# Altium project Timer_Clock_BOT.PrjPcb
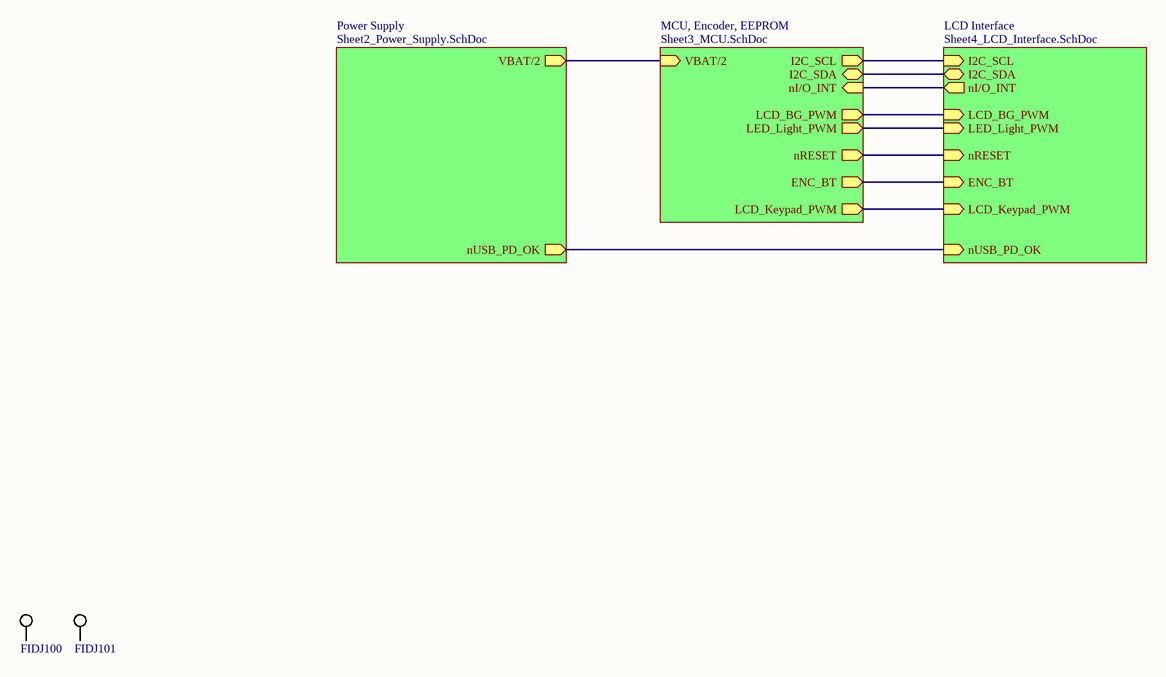
[diagram p0: Sheet1_Overview.SchDoc]
ProjectName: Alarm Clock - PCB BOT; Revision: V2.0; Signature1: Marius Tetard; Signature2: 2022-06 / Freiburg
4 sheets, 131 parts. Net scope: hierarchical (ports join the sheet entries above them; power ports are global).
Sheets:
  Sheet1_Overview.SchDoc
    Power Supply = Sheet2_Power_Supply.SchDoc
    MCU, Encoder, EEPROM = Sheet3_MCU.SchDoc
    LCD Interface = Sheet4_LCD_Interface.SchDoc

## Sheet Sheet1_Overview.SchDoc: =ProjectName
size A4; Organization: Marius Tetard; Address1: 2022-06 / Freiburg; DocumentNumber: 1; Revision: V2.0; SheetNumber: 1; SheetTotal: 4

### Parts
FIDJ100  Fiducial  [FIDJ_1mm]  (value not drawn)  (net tie, no BOM)
FIDJ101  Fiducial  [FIDJ_1mm]  (value not drawn)  (net tie, no BOM)

### Sub-sheets
LCD Interface = Sheet4_LCD_Interface.SchDoc: nI/O_INT (out), I2C_SCL (in), LCD_BG_PWM (in), nRESET (in), LED_Light_PWM (in), I2C_SDA (bidir), ENC_BT (in), LCD_Keypad_PWM (in), nUSB_PD_OK (in)
MCU, Encoder, EEPROM = Sheet3_MCU.SchDoc: nI/O_INT (in), I2C_SCL (out), LCD_BG_PWM (out), LED_Light_PWM (out), I2C_SDA (bidir), VBAT/2 (in), LCD_Keypad_PWM (out), nRESET (out), ENC_BT (out)
Power Supply = Sheet2_Power_Supply.SchDoc: nUSB_PD_OK (out), VBAT/2 (out)

### Nets
ENC_BT: sheet MCU, Encoder, EEPROM/ENC_BT, sheet LCD Interface/ENC_BT
I2C_SCL: sheet MCU, Encoder, EEPROM/I2C_SCL, sheet LCD Interface/I2C_SCL
I2C_SDA: sheet MCU, Encoder, EEPROM/I2C_SDA, sheet LCD Interface/I2C_SDA
LCD_BG_PWM: sheet MCU, Encoder, EEPROM/LCD_BG_PWM, sheet LCD Interface/LCD_BG_PWM
LCD_Keypad_PWM: sheet MCU, Encoder, EEPROM/LCD_Keypad_PWM, sheet LCD Interface/LCD_Keypad_PWM
LED_Light_PWM: sheet MCU, Encoder, EEPROM/LED_Light_PWM, sheet LCD Interface/LED_Light_PWM
nI/O_INT: sheet MCU, Encoder, EEPROM/nI/O_INT, sheet LCD Interface/nI/O_INT
nRESET: sheet MCU, Encoder, EEPROM/nRESET, sheet LCD Interface/nRESET
nUSB_PD_OK: sheet Power Supply/nUSB_PD_OK, sheet LCD Interface/nUSB_PD_OK
VBAT/2: sheet Power Supply/VBAT/2, sheet MCU, Encoder, EEPROM/VBAT/2

Not connected (* = marked no-connect by the designer): FIDJ100 1; FIDJ101 1

### Notes on the sheet
- Title
- Size:
- Date:
- A4
- Number:
- Time:
- Revision:
- Sheet
- of
- File:

### Library data of the parts
FIDJ100 FIDJ101 = FIDJ_1mm: Fiducal 1mm

## Sheet Sheet2_Power_Supply.SchDoc: =ProjectName
size A4; Organization: Marius Tetard; Address1: 2022-06 / Freiburg; DocumentNumber: 2; Revision: V2.0; SheetNumber: 2; SheetTotal: 4
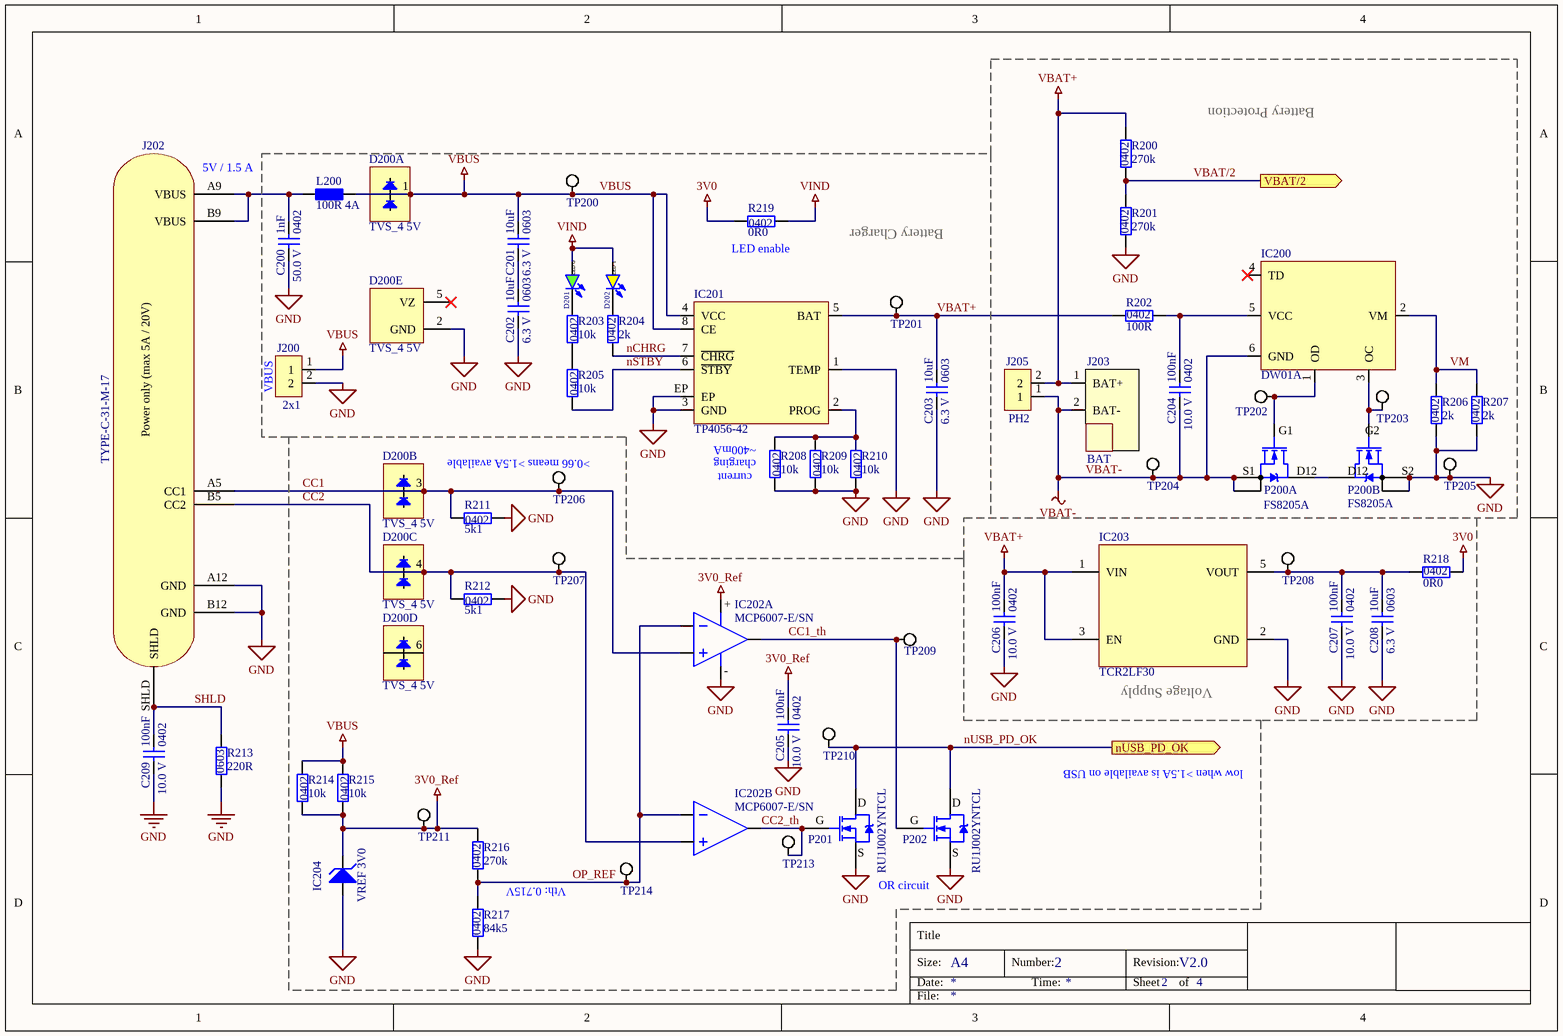
[diagram p1: Sheet2_Power_Supply.SchDoc]

### Parts
C200  Capacitance: 1nF  Footprint: 0402  Voltage: 50.0 V  [C_0402]  (hidden comment: C 1nF 0402 50V)
C201  Capacitance: 10uF  Footprint: 0603  Voltage: 6.3 V  [C_0603]  (hidden comment: C 10uF 0603 6.3V)
C202  Capacitance: 10uF  Footprint: 0603  Voltage: 6.3 V  [C_0603]  (hidden comment: C 10uF 0603 6.3V)
C203  Capacitance: 10uF  Footprint: 0603  Voltage: 6.3 V  [C_0603]  (hidden comment: C 10uF 0603 6.3V)
C204  Capacitance: 100nF  Footprint: 0402  Voltage: 10.0 V  [C_0402]  (hidden comment: C 100nF 0402 10V)
C205  Capacitance: 100nF  Footprint: 0402  Voltage: 10.0 V  [C_0402]  (hidden comment: C 100nF 0402 10V)
C206  Capacitance: 100nF  Footprint: 0402  Voltage: 10.0 V  [C_0402]  (hidden comment: C 100nF 0402 10V)
C207  Capacitance: 100nF  Footprint: 0402  Voltage: 10.0 V  [C_0402]  (hidden comment: C 100nF 0402 10V)
C208  Capacitance: 10uF  Footprint: 0603  Voltage: 6.3 V  [C_0603]  (hidden comment: C 10uF 0603 6.3V)
C209  Capacitance: 100nF  Footprint: 0402  Voltage: 10.0 V  [C_0402]  (hidden comment: C 100nF 0402 10V)
D200  TVS_4 5V  [SOT-23-6]  (parts A,B,C,D,E of 5)
D201  LED G  [LED_0603]
D202  LED Y  [LED_0603]
IC200  DW01A  [SOT-23-6]
IC201  TP4056-42  [SOIC-8-EP]
IC202  MCP6007-E/SN  [SOIC-8]  (parts A,B of 2)
IC203  TCR2LF30  [SOT-23-5]
IC204  VREF 3V0  [SOT-23-3]
J200  2x1  [PH_1x2]
J202  TYPE-C-31-M-17  [Con_TYPE-C-31-M-17]
J203  BAT  [J_BAT_CLIP_18650]
J204  BAT  (value not drawn)  (mechanical)
J205  PH2  [J_S2B-PH-K-S]
L200  Inductance: 100R 4A  [L_1206]  (hidden comment: L Ferrite 100R 4A)
P200  Manufacturer Part Number: FS8205A  [TSSOP-8_4.4mm]  (hidden comment: P2 NMOS 20V 6A)  (parts A,B of 2)
P201  Manufacturer Part Number: RU1J002YNTCL  [UMT3F]  (hidden comment: P_NCH_50V_150mW)
P202  Manufacturer Part Number: RU1J002YNTCL  [UMT3F]  (hidden comment: P_NCH_50V_150mW)
R200  Resistance: 270k  Footprint: 0402  [R_0402]  (hidden comment: R 270k 0402)
R201  Resistance: 270k  Footprint: 0402  [R_0402]  (hidden comment: R 270k 0402)
R202  Resistance: 100R  Footprint: 0402  [R_0402]  (hidden comment: R 100R 0402)
R203  Resistance: 10k  Footprint: 0402  [R_0402]  (hidden comment: R 10k 0402)
R204  Resistance: 2k  Footprint: 0402  [R_0402]  (hidden comment: R 2k 0402)
R205  Resistance: 10k  Footprint: 0402  [R_0402]  (hidden comment: R 10k 0402)
R206  Resistance: 2k  Footprint: 0402  [R_0402]  (hidden comment: R 2k 0402)
R207  Resistance: 2k  Footprint: 0402  [R_0402]  (hidden comment: R 2k 0402)
R208  Resistance: 10k  Footprint: 0402  [R_0402]  (hidden comment: R 10k 0402)
R209  Resistance: 10k  Footprint: 0402  [R_0402]  (hidden comment: R 10k 0402)
R210  Resistance: 10k  Footprint: 0402  [R_0402]  (hidden comment: R 10k 0402)
R211  Resistance: 5k1  Footprint: 0402  [R_0402]  (hidden comment: R 5k1 0402)
R212  Resistance: 5k1  Footprint: 0402  [R_0402]  (hidden comment: R 5k1 0402)
R213  Resistance: 220R  Footprint: 0603  [R_0603]  (hidden comment: R 220R 0603)
R214  Resistance: 10k  Footprint: 0402  [R_0402]  (hidden comment: R 10k 0402)
R215  Resistance: 10k  Footprint: 0402  [R_0402]  (hidden comment: R 10k 0402)
R216  Resistance: 270k  Footprint: 0402  [R_0402]  (hidden comment: R 270k 0402)
R217  Resistance: 84k5  Footprint: 0402  [R_0402]  (hidden comment: R 84k5 0402)
R218  Resistance: 0R0  Footprint: 0402  [R_0402]  (hidden comment: R 0R0 0402)
R219  Resistance: 0R0  Footprint: 0402  [R_0402]  (hidden comment: R 0R0 0402)
TP200  TP  [TP_1mm]  (value not drawn)  (net tie, no BOM)
TP201  TP  [TP_1mm]  (value not drawn)  (net tie, no BOM)
TP202  TP  [TP_1mm]  (value not drawn)  (net tie, no BOM)
TP203  TP  [TP_1mm]  (value not drawn)  (net tie, no BOM)
TP204  TP  [TP_1mm]  (value not drawn)  (net tie, no BOM)
TP205  TP  [TP_1mm]  (value not drawn)  (net tie, no BOM)
TP206  TP  [TP_1mm]  (value not drawn)  (net tie, no BOM)
TP207  TP  [TP_1mm]  (value not drawn)  (net tie, no BOM)
TP208  TP  [TP_1mm]  (value not drawn)  (net tie, no BOM)
TP209  TP  [TP_1mm]  (value not drawn)  (net tie, no BOM)
TP210  TP  [TP_1mm]  (value not drawn)  (net tie, no BOM)
TP211  TP  [TP_1mm]  (value not drawn)  (net tie, no BOM)
TP213  TP  [TP_1mm]  (value not drawn)  (net tie, no BOM)
TP214  TP  [TP_1mm]  (value not drawn)  (net tie, no BOM)

### Ports
nUSB_PD_OK (out), VBAT/2 (out)

### Nets
3V0: R218.2 R219.2
3V0_Ref: C205.2 IC202.8(VDD) IC204.1(K) R214.1 R215.1 R216.2 TP211.1(TP)
GND: C200.1 C202.1 C203.1 C205.1 C206.1 C207.1 C208.1 C209.1 D200.2(GND) IC201.1(TEMP) IC201.3(GND) IC201.EP IC202.4(VSS) IC203.2(GND) IC204.2(A) J200.2 J202.A12(GND) J202.B12(GND) P200.6(S2) P200.7(S2) P201.2(S) P202.2(S) R201.1 R206.1 R207.1 R208.1 R209.1 R210.1 R211.1 R212.1 R213.1 R217.1 TP205.1(TP)
VBAT+: C203.2 C206.2 IC201.5(BAT) IC203.1(VIN) IC203.3(EN) J203.1(BAT+) J205.2 R200.2 R202.1 TP201.1(TP)
VBAT-: C204.1 IC200.6(GND) J203.2(BAT-) J205.1 P200.2(S1) P200.3(S1) TP204.1(TP)
VBUS: C201.2 D200.1 IC201.4(VCC) IC201.8(CE) J200.1 L200.2 R214.2 R215.2 TP200.1(TP)
VIND: D201.A D202.A R219.1
CC1: D200.3 IC202.3(INA+) J202.A5(CC1) R211.2 TP206.1(TP)
CC1_th: IC202.1(OUTA) P202.1(G) TP209.1(TP)
CC2: D200.4 IC202.5(INB+) J202.B5(CC2) R212.2 TP207.1(TP)
CC2_th: IC202.7(OUTB) P201.1(G) TP213.1(TP)
nCHRG: IC201.7(~{CHRG}) R204.1
nSTBY: IC201.6(~{STBY}) R205.1
nUSB_PD_OK: P201.3(D) P202.3(D) TP210.1(TP) ; port nUSB_PD_OK
OP_REF: IC202.2(INA-) IC202.6(INB-) R216.1 R217.2 TP214.1(TP)
SHLD: C209.2 J202.SHLD R213.2
VBAT/2: R200.1 R201.2 ; port VBAT/2
VM: IC200.2(VM) R206.2 R207.2
NetC200_2: C200.2 J202.A9(VBUS) J202.B9(VBUS) L200.1
NetC201_1: C201.1 C202.2
NetC204_2: C204.2 IC200.5(VCC) R202.2
NetC207_2: C207.2 C208.2 IC203.5(VOUT) R218.1 TP208.1(TP)
NetD201_K: D201.K R203.2
NetD202_K: D202.K R204.2
NetIC200_1: IC200.1(OD) P200.4(G1) TP202.1(TP)
NetIC200_3: IC200.3(OC) P200.5(G1) TP203.1(TP)
NetIC201_2: IC201.2(PROG) R208.2 R209.2 R210.2
NetP200_1: P200.1(D12) P200.8(D12)
NetR203_1: R203.1 R205.2

Not connected (* = marked no-connect by the designer): D200 5(VZ)* 6; IC200 4(TD)*

### Notes on the sheet
- Battery Protection
- (near J202) 5V / 1.5 A
- (near R219) LED enable
- Battery Charger
- (near J200) VBUS
- ~400mA
- (near TP206) >0.66 means >1.5A available
- (near R208) charging
- (near R208) current
- (near IC203) Voltage Supply
- low when >1.5A is available on USB
- Vth: 0.715V
- OR circuit
- Title
- Size:
- Date:
- A4
- Number:
- Time:
- Revision:
- Sheet
- of
- File:
- (in symbol IC_OpAmp_MCP6007-E/SN, part A) +; -
- (in symbol J_USB-C_2) Power only (max 5A / 20V)
- (in symbol P_2NCH_20V_1W, part B) G2

### Library data of the parts
C200 = CAP_1nF_50V_0402: CAP CER 1000PF 50V C0G/NP0 0402; Manufacturer: Murata Electronics; Manufacturer Part Number: GRM1555C1H102JA01J; Type: Capacitor; Supplier 1: Digi-Key; Supplier Part Number 1: 490-6190-1-ND
C201-C203 C208 = CAP_10uF_6V3_0603: CAP CER 10UF 6.3V X5R 0603; Manufacturer: Taiyo Yuden; Manufacturer Part Number: JMK107ABJ106MA-T; Type: Capacitor; Supplier 1: Digi-Key; Supplier Part Number 1: 587-5869-1-ND
C204-C207 C209 = CAP_100nF_10V_0402: CAP CER 0.1UF 10V X5R 0402; Manufacturer: Samsung Electro-Mechanics; Manufacturer Part Number: CL05A104MP5NNNC; Type: Capacitor; Supplier 1: Digi-Key; Supplier Part Number 1: 1276-1443-1-ND
D200 = D_TVS_U4_12V5: TVS DIODE 5VWM 12.5VC SOT23-6; Manufacturer: Comchip Technology; Manufacturer Part Number: CPDT6-5V0UPC-HF; Type: Diode, TVS; Supplier 1: Digi-Key; Supplier Part Number 1: 641-1829-1-ND
D201 = D_LED_Green_0603: LED GREEN DIFFUSED 0603 SMD; Manufacturer: OSRAM Opto Semiconductors Inc.; Manufacturer Part Number: LT Q39G-Q1OO-25-1; Type: Diode, LED; Supplier 1: Digi-Key; Supplier Part Number 1: 475-3442-1-ND
D202 = D_LED_Yellow_0603: LED YELLOW DIFFUSED; Manufacturer: Stanley Electric Co; Manufacturer Part Number: FKY1111C-TR; Type: Diode, LED; Supplier 1: Digi-Key; Supplier Part Number 1: 404-1273-1-ND
IC200 = IC_BAT_PROT_DW01A: IC BATT MANAGEMENT SOT-23-6; Manufacturer: PUOLOP; Manufacturer Part Number: DW01A; Type: IC; Supplier 1: LCSC; Supplier Part Number 1: C351410
IC201 = IC_BAT_CHGR_TP4056: IC BATT CHG LI-ION 1CELL ESOP-8-EP; Manufacturer: TOPPOWER(Nanjing Extension Microelectronics); Manufacturer Part Number: TP4056-42-ESOP8; Type: IC; Supplier 1: LCSC; Supplier Part Number 1: C16581
IC202 = IC_OpAmp_MCP6007-E/SN: DUAL, 1MHZ OP AMP, E TEMP; Manufacturer: Microchip Technology; Type: IC, OpAmp; Supplier 1: Digi-Key; Supplier Part Number 1: 150-MCP6007-E/SN-ND; Manufacturer Part Number: MCP6007-E/SN
IC203 = IC_Reg_TCR2LF30: IC REG LINEAR 3V 200MA SMV; Manufacturer: Toshiba Semiconductor and Storage; Manufacturer Part Number: TCR2LF30,LM(CT; Type: IC, Regulator; Supplier 1: Digi-Key; Supplier Part Number 1: TCR2LF30LM(CTCT-ND
IC204 = IC_Ref_LM4040DIM3X-3.0: IC VREF SHUNT 1% SOT23-3; Manufacturer: Texas Instruments; Manufacturer Part Number: LM4040DIM3X-3.0/NOPB; Type: IC, Reference; Supplier 1: Digi-Key; Supplier Part Number 1: 296-41429-1-ND
J200 = J_MH2x1_2.54: CONN HEADER VERT 2POS 2.54MM; Manufacturer: Sullins Connector Solutions; Manufacturer Part Number: PRPC002SAAN-RC; Pitch: 2.54; Type: Connector; Supplier 1: Digi-Key; Supplier Part Number 1: S1011EC-02-ND; Pins: 2
J202 = J_USB-C_2: USB4 GEN3, TYPE C, TOP MOUNT; Manufacturer: Korean Hroparts Elec; Manufacturer Part Number: TYPE-C-31-M-17; Type: Connector; Supplier 1: LCSC; Supplier Part Number 1: C283540; Pins: 6; Pitch: *
J203 = J_BAT_CLIP_18650_A: SMT Battery Connectors 18650; Manufacturer: MYOUNG; Manufacturer Part Number: MY-18650-02; Type: other; Supplier 1: LCSC; Supplier Part Number 1: C2979182; Pins: 2
J204 = J_BAT_CLIP_18650_B: SMT Battery Connectors 18650; Manufacturer: MYOUNG; Manufacturer Part Number: MY-18650-02; Type: other; Supplier 1: LCSC; Supplier Part Number 1: C2979182; Pins: 2
J205 = J_S2B-PH-KL: CONN HEADER R/A 2POS 2MM; Manufacturer: JST Sales America Inc.; Manufacturer Part Number: S2B-PH-KL(LF)(SN); Pitch: 2; Type: Connector; Supplier 1: LCSC; Supplier Part Number 1: C160237; Pins: 2
L200 = L_100R_4A: FIXED IND 100 4000MA 1206; Manufacturer: Eaton - Electronics Division; Manufacturer Part Number: MFBM1V3216-101-R; Type: Inductor, Ferrite; Supplier 1: Digi-Key; Supplier Part Number 1: 283-MFBM1V3216-101-RCT-ND
P200 = P_2NCH_20V_1W: MOSFET 2N_CH 20V 6A TSSOP-8; Manufacturer: Fortune Semicon; Type: Transistor; Supplier 1: LCSC; Supplier Part Number 1: C16052
P201 P202 = P_NCH_50V_150mW: MOSFET N-CH 50V 200MA UMT3F; Manufacturer: Rohm Semiconductor; Type: Transistor; Supplier 1: Digi-Key; Supplier Part Number 1: RU1J002YNTCLCT-ND
R200 R201 R216 = R_270k_0402: RES 270K OHM 1% 1/16W 0402; Manufacturer: YAGEO; Manufacturer Part Number: RC0402FR-07270KL; Type: Resistor; Supplier 1: Digi-Key; Supplier Part Number 1: 311-270KLRCT-ND
R202 = R_100R_0402: RES 100 OHM 1% 1/16W 0402; Manufacturer: Stackpole Electronics Inc; Manufacturer Part Number: RMCF0402FT100R; Type: Resistor; Supplier 1: Digi-Key; Supplier Part Number 1: RMCF0402FT100RCT-ND
R203 R205 R208-R210 R214 R215 = R_10k_0402: RES 10K OHM 1% 1/16W 0402; Manufacturer: YAGEO; Manufacturer Part Number: RC0402FR-0710KL; Type: Resistor; Supplier 1: Digi-Key; Supplier Part Number 1: 311-10.0KLRCT-ND
R204 R206 R207 = R_2k_0402: RES 2K OHM 1% 1/16W 0402; Manufacturer: Stackpole Electronics Inc; Manufacturer Part Number: RMCF0402FT2K00; Type: Resistor; Supplier 1: Digi-Key; Supplier Part Number 1: RMCF0402FT2K00CT-ND
R211 R212 = R_5k1_0420: RES 5.1K OHM 1% 1/16W 0402; Manufacturer: Stackpole Electronics Inc; Manufacturer Part Number: RMCF0402FT5K10; Type: Resistor; Supplier 1: Digi-Key; Supplier Part Number 1: RMCF0402FT5K10CT-ND
R213 = R_220R_0603: RES 220 OHM 1% 1/10W 0603; Manufacturer: Stackpole Electronics Inc; Manufacturer Part Number: RMCF0603FT220R; Type: Resistor; Supplier 1: Digi-Key; Supplier Part Number 1: RMCF0603FT220RCT-ND
R217 = R_84k5_0402: RES SMD 84.5K OHM 1% 1/16W 0402; Manufacturer: Vishay Dale; Manufacturer Part Number: CRCW040284K5FKED; Type: Resistor; Supplier 1: Digi-Key; Supplier Part Number 1: 541-84.5KLCT-ND
R218 R219 = R_0R0_0402: RES 0 OHM JUMPER 1/16W 0402; Manufacturer: Stackpole Electronics Inc; Manufacturer Part Number: RMCF0402ZT0R00; Type: Resistor; Supplier 1: Digi-Key; Supplier Part Number 1: RMCF0402ZT0R00CT-ND
TP200-TP211 TP213 TP214 = TP_1mm: Test Point 1mm

## Sheet Sheet3_MCU.SchDoc: =ProjectName
size A4; Organization: Marius Tetard; Address1: 2022-06 / Freiburg; DocumentNumber: 3; Revision: V2.0; SheetNumber: 3; SheetTotal: 4
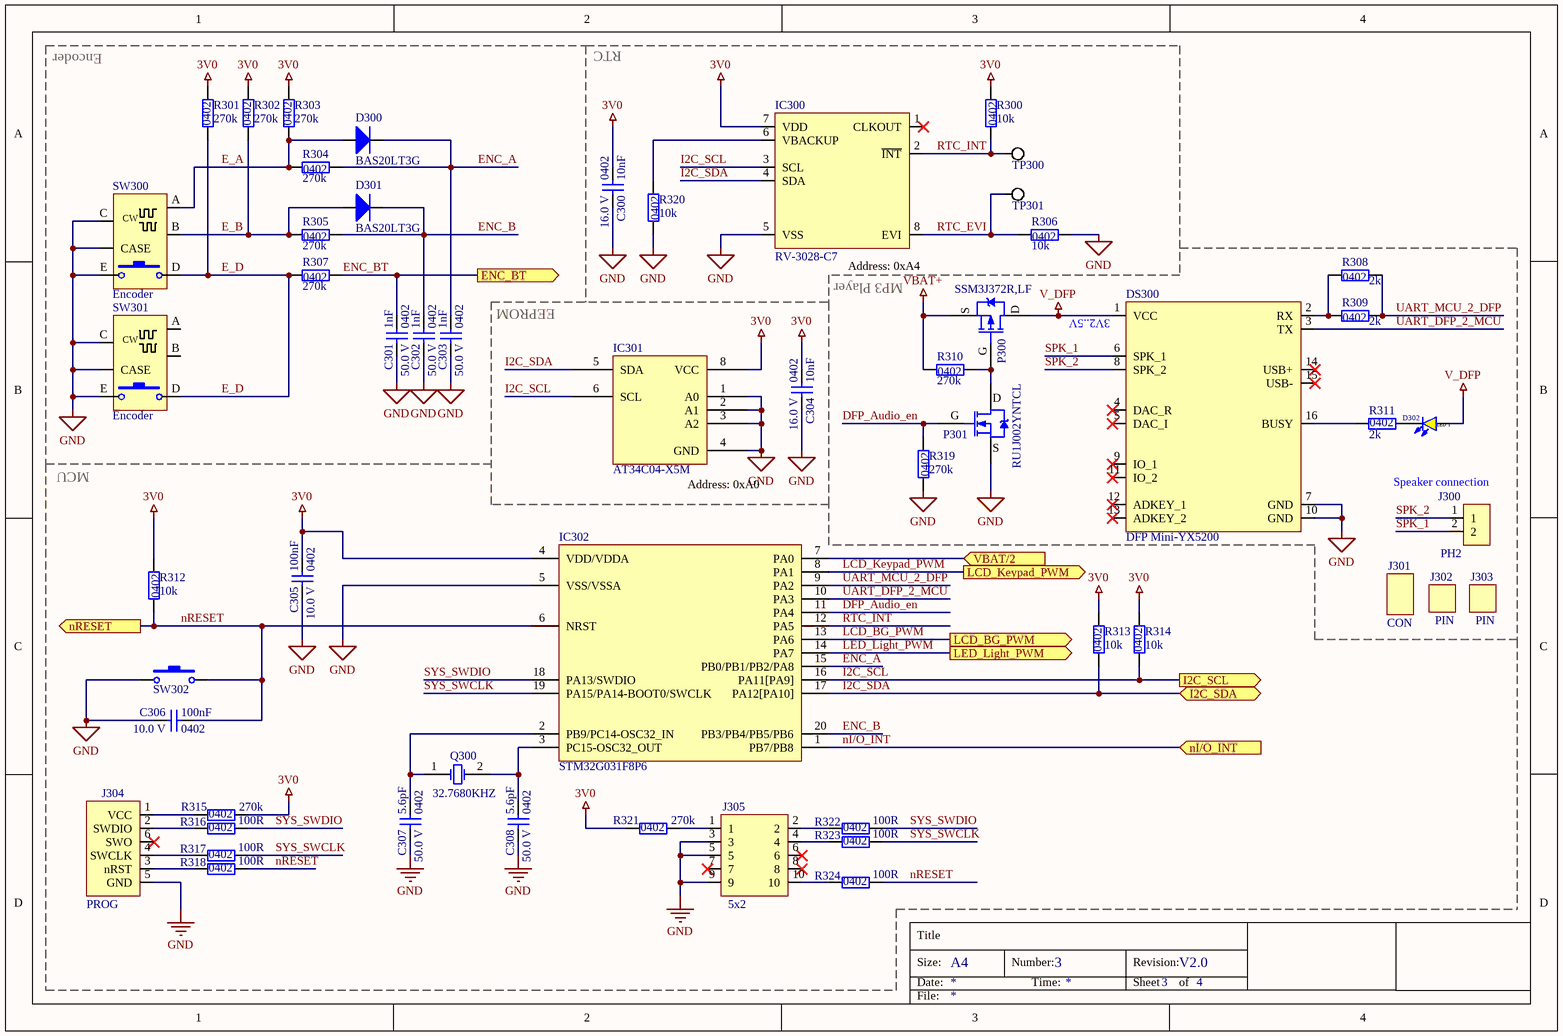
[diagram p2: Sheet3_MCU.SchDoc]

### Parts
C300  Capacitance: 10nF  Footprint: 0402  Voltage: 16.0 V  [C_0402]  (hidden comment: C 10nF 0402 16V)
C301  Capacitance: 1nF  Footprint: 0402  Voltage: 50.0 V  [C_0402]  (hidden comment: C 1nF 0402 50V)
C302  Capacitance: 1nF  Footprint: 0402  Voltage: 50.0 V  [C_0402]  (hidden comment: C 1nF 0402 50V)
C303  Capacitance: 1nF  Footprint: 0402  Voltage: 50.0 V  [C_0402]  (hidden comment: C 1nF 0402 50V)
C304  Capacitance: 10nF  Footprint: 0402  Voltage: 16.0 V  [C_0402]  (hidden comment: C 10nF 0402 16V)
C305  Capacitance: 100nF  Footprint: 0402  Voltage: 10.0 V  [C_0402]  (hidden comment: C 100nF 0402 10V)
C306  Capacitance: 100nF  Footprint: 0402  Voltage: 10.0 V  [C_0402]  (hidden comment: C 100nF 0402 10V)
C307  Capacitance: 5.6pF  Footprint: 0402  Voltage: 50.0 V  [C_0402]  (hidden comment: C 5.6pF 0402 50V)
C308  Capacitance: 5.6pF  Footprint: 0402  Voltage: 50.0 V  [C_0402]  (hidden comment: C 5.6pF 0402 50V)
D300  BAS20LT3G  [SOT-23-3]
D301  BAS20LT3G  [SOT-23-3]
D302  LED Y  [LED_0603]
DS300  DFP Mini-YX5200  [DFP_Player_Mini]
IC300  RV-3028-C7  [MC-C7]
IC301  AT34C04-X5M  [TSSOP-8_4.4mm]
IC302  STM32G031F8P6  [TSSOP-20]
J300  PH2  [J_S2B-PH-K-S]
J301  CON  (mechanical)
J302  PIN  (mechanical)
J303  PIN  (mechanical)
J304  PROG  [J_TC2030-IDC-NL]  (no BOM)
J305  5x2  [J_MH5x2_1.27-STM32]
P300  Manufacturer Part Number: SSM3J372R,LF  [SOT-23-3-F]  (hidden comment: P PMOS 30V 6A)
P301  Manufacturer Part Number: RU1J002YNTCL  [UMT3F]  (hidden comment: P_NCH_50V_150mW)
Q300  32.7680KHZ  [Q2_3.2x1.5]
R300  Resistance: 10k  Footprint: 0402  [R_0402]  (hidden comment: R 10k 0402)
R301  Resistance: 270k  Footprint: 0402  [R_0402]  (hidden comment: R 270k 0402)
R302  Resistance: 270k  Footprint: 0402  [R_0402]  (hidden comment: R 270k 0402)
R303  Resistance: 270k  Footprint: 0402  [R_0402]  (hidden comment: R 270k 0402)
R304  Resistance: 270k  Footprint: 0402  [R_0402]  (hidden comment: R 270k 0402)
R305  Resistance: 270k  Footprint: 0402  [R_0402]  (hidden comment: R 270k 0402)
R306  Resistance: 10k  Footprint: 0402  [R_0402]  (hidden comment: R 10k 0402)
R307  Resistance: 270k  Footprint: 0402  [R_0402]  (hidden comment: R 270k 0402)
R308  Resistance: 2k  Footprint: 0402  [R_0402]  (hidden comment: R 2k 0402)
R309  Resistance: 2k  Footprint: 0402  [R_0402]  (hidden comment: R 2k 0402)
R310  Resistance: 270k  Footprint: 0402  [R_0402]  (hidden comment: R 270k 0402)
R311  Resistance: 2k  Footprint: 0402  [R_0402]  (hidden comment: R 2k 0402)
R312  Resistance: 10k  Footprint: 0402  [R_0402]  (hidden comment: R 10k 0402)
R313  Resistance: 10k  Footprint: 0402  [R_0402]  (hidden comment: R 10k 0402)
R314  Resistance: 10k  Footprint: 0402  [R_0402]  (hidden comment: R 10k 0402)
R315  Resistance: 270k  Footprint: 0402  [R_0402]  (hidden comment: R 270k 0402)
R316  Resistance: 100R  Footprint: 0402  [R_0402]  (hidden comment: R 100R 0402)
R317  Resistance: 100R  Footprint: 0402  [R_0402]  (hidden comment: R 100R 0402)
R318  Resistance: 100R  Footprint: 0402  [R_0402]  (hidden comment: R 100R 0402)
R319  Resistance: 270k  Footprint: 0402  [R_0402]  (hidden comment: R 270k 0402)
R320  Resistance: 10k  Footprint: 0402  [R_0402]  (hidden comment: R 10k 0402)
R321  Resistance: 270k  Footprint: 0402  [R_0402]  (hidden comment: R 270k 0402)
R322  Resistance: 100R  Footprint: 0402  [R_0402]  (hidden comment: R 100R 0402)
R323  Resistance: 100R  Footprint: 0402  [R_0402]  (hidden comment: R 100R 0402)
R324  Resistance: 100R  Footprint: 0402  [R_0402]  (hidden comment: R 100R 0402)
SW300  Encoder  [PEC11R]
SW301  Encoder  [PEC11R]
SW302  SW  [SW_PTS810]  (value not drawn)
TP300  TP  [TP_1mm]  (value not drawn)  (net tie, no BOM)
TP301  TP  [TP_1mm]  (value not drawn)  (net tie, no BOM)

### Blocks framed on the sheet
EEPROM: C304 IC301

### Ports
ENC_BT (out), I2C_SCL (out), I2C_SDA (bidir), LCD_BG_PWM (out), LCD_Keypad_PWM (out), LED_Light_PWM (out), nI/O_INT (in), nRESET (out), VBAT/2 (in)

### Nets
3V0: C300.2 C304.2 C305.2 IC300.7(VDD) IC301.8(VCC) IC302.4(VDD/VDDA) R300.2 R301.2 R302.2 R303.2 R312.2 R313.2 R314.2 R315.2 R321.1
GND: C300.1 C301.1 C302.1 C303.1 C304.1 C305.1 C306.1 C307.1 C308.1 DS300.7(GND) DS300.10(GND) IC300.5(VSS) IC301.1(A0) IC301.2(A1) IC301.3(A2) IC301.4(GND) IC302.5(VSS/VSSA) J304.5(GND) J305.3 J305.5 J305.9 P301.2(S) R306.2 R319.2 R320.1 SW300.C SW300.CASE SW300.E SW301.C SW301.CASE SW301.E SW302.1(1,_2)
V_DFP: D302.A DS300.1(VCC) P300.3(D)
VBAT+: P300.2(S) R310.2
DFP_Audio_en: IC302.11(PA4) P301.1(G) R319.1
E_A: D300.1(A) R303.1 R304.2 SW300.A
E_B: D301.1(A) R302.1 R305.2 SW300.B
E_D: R301.1 R307.2 SW300.D SW301.D
ENC_A: C303.2 D300.3(K) IC302.15(PB0/PB1/PB2/PA8) R304.1
ENC_B: C302.2 D301.3(K) IC302.20(PB3/PB4/PB5/PB6) R305.1
ENC_BT: C301.2 R307.1 ; port ENC_BT
I2C_SCL: IC300.3(SCL) IC301.6(SCL) IC302.16(PA11[PA9]) R314.1 ; port I2C_SCL
I2C_SDA: IC300.4(SDA) IC301.5(SDA) IC302.17(PA12[PA10]) R313.1 ; port I2C_SDA
LCD_BG_PWM: IC302.13(PA6) ; port LCD_BG_PWM
LCD_Keypad_PWM: IC302.8(PA1) ; port LCD_Keypad_PWM
LED_Light_PWM: IC302.14(PA7) ; port LED_Light_PWM
nI/O_INT: IC302.1(PB7/PB8) ; port nI/O_INT
nRESET: C306.2 IC302.6(NRST) R312.1 R318.2 R324.2 SW302.3(2,_3) ; port nRESET
RTC_EVI: IC300.8(EVI) R306.1 TP301.1(TP)
RTC_INT: IC300.2(~{INT}) IC302.12(PA5) R300.1 TP300.1(TP)
SPK_1: DS300.6(SPK_1) J300.2
SPK_2: DS300.8(SPK_2) J300.1
SYS_SWCLK: IC302.19(PA15/PA14-BOOT0/SWCLK) R317.2 R323.2
SYS_SWDIO: IC302.18(PA13/SWDIO) R316.2 R322.2
UART_DFP_2_MCU: DS300.3(TX) IC302.10(PA3)
UART_MCU_2_DFP: IC302.9(PA2) R308.1 R309.1
VBAT/2: IC302.7(PA0) ; port VBAT/2
NetC307_2: C307.2 IC302.2(PB9/PC14-OSC32_IN) Q300.1(OSC1)
NetC308_2: C308.2 IC302.3(PC15-OSC32_OUT) Q300.2(OSC2)
NetD302_K: D302.K R311.2
NetDS300_2: DS300.2(RX) R308.2 R309.2
NetDS300_16: DS300.16(BUSY) R311.1
NetIC300_6: IC300.6(VBACKUP) R320.2
NetJ304_1: J304.1(VCC) R315.1
NetJ304_2: J304.2(SWDIO) R316.1
NetJ304_3: J304.3(nRST) R318.1
NetJ304_4: J304.4(SWCLK) R317.1
NetJ305_1: J305.1 R321.2
NetJ305_2: J305.2 R322.1
NetJ305_4: J305.4 R323.1
NetJ305_10: J305.10 R324.1
NetP300_1: P300.1(G) P301.3(D) R310.1

Not connected (* = marked no-connect by the designer): DS300 4(DAC_R)* 5(DAC_I)* 9(IO_1)* 11(IO_2)* 12(ADKEY_1)* 13(ADKEY_2)* 14(USB+)* 15(USB-)*; IC300 1(CLKOUT)*; J304 6(SWO)*; J305 6* 7* 8*; SW301 A B

### Notes on the sheet
- Encoder
- RTC
- (near IC300) Address: 0xA4
- (near IC300) MP3 Player
- (near DS300) 3V2..5V
- MCU
- (near IC301) Address: 0xA0
- (near J300) Speaker connection
- Title
- Size:
- Date:
- A4
- Number:
- Time:
- Revision:
- Sheet
- of
- File:
- (in symbol ENC_12_THT) CW

### Library data of the parts
C300 C304 = CAP_10nF_16V_0402: CAP CER 10000PF 16V Y5V 0402; Manufacturer: Samsung Electro-Mechanics; Manufacturer Part Number: CL05F103ZO5NNNC; Type: Capacitor; Supplier 1: Digi-Key; Supplier Part Number 1: 1276-1738-1-ND
C301-C303 = CAP_1nF_50V_0402: as C200 on sheet Sheet2_Power_Supply; Supplier 1: Digi-Key; Supplier Part Number 1: 490-6190-1-ND
C305 C306 = CAP_100nF_10V_0402: as C204 on sheet Sheet2_Power_Supply; Supplier 1: Digi-Key; Supplier Part Number 1: 1276-1443-1-ND
C307 C308 = CAP_5.6PF_50V_0402: CAP CER 5.6PF 50V C0G/NP0 0402; Manufacturer: Samsung Electro-Mechanics; Manufacturer Part Number: CL05C5R6DB5NNNC; Type: Capacitor; Supplier 1: Digi-Key; Supplier Part Number 1: 1276-1712-1-ND
D300 D301 = D_LL_200V_200mA: DIODE GP 200V 200MA SOT23-3; Manufacturer: onsemi; Type: Diode; Supplier 1: Digi-Key; Supplier Part Number 1: BAS20LT3GOSCT-ND; Manufacturer Part Number: BAS20LT3G
D302 = D_LED_Yellow_0603: as D202 on sheet Sheet2_Power_Supply; Supplier 1: Digi-Key; Supplier Part Number 1: 404-1273-1-ND
DS300 = DFP_Player_mini: Mini-YX5200 Audio MP3 Modul; Manufacturer: DFRobot; Manufacturer Part Number: DFR0299; Type: other; Supplier 1: AliExpress; Supplier Part Number 1: 33036928283
IC300 = IC_RTC_3028-C7: IC RTC CLK/CALENDAR I2C 10SON; Manufacturer: Micro Crystal AG; Manufacturer Part Number: RV-3028-C7TAQC; Type: IC, RTC; Supplier 1: Mouser; Supplier Part Number 1: 428-203591-MG01
IC301 = IC_EEPROM_AT34C04: IC EEPROM 4KBIT I2C 1MHZ 8TSSOP; Manufacturer: Microchip Technology; Manufacturer Part Number: AT34C04-X5M-T; Type: IC, EEPROM; Supplier 1: Digi-Key; Supplier Part Number 1: AT34C04-X5M-TCT-ND
IC302 = IC_MCU_STM32G031F8P6: IC MCU 32BIT 32KB FLASH 20TSSOP; Manufacturer: STMicroelectronics; Manufacturer Part Number: STM32G031F8P6; Type: IC, MCU; Supplier 1: LCSC; Supplier Part Number 1: C529334
J300 = J_S2B-PH-KL: as J205 on sheet Sheet2_Power_Supply; Type: Connector; Supplier 1: LCSC; Supplier Part Number 1: C160237; Pins: 2
J301 = J_PHR-2-R: CONN CONNECTOR PH 2POS 2MM; Manufacturer: JST Sales America Inc.; Pitch: 2; Manufacturer Part Number: PHR-2-R; Type: Connector; Supplier 1: LCSC; Supplier Part Number 1: C398543; Pins: 2
J302 J303 = J_PHR-2-R_PIN: PIN INSERT; Manufacturer: JST Sales America Inc.; Manufacturer Part Number: SPH-004T-P0.5S; Type: Connector; Supplier 1: LCSC; Supplier Part Number 1: C160351
J304 = J_TC2030-IDC-NL: SWD Programmer No Legs; Manufacturer: Tag_connect; Manufacturer Part Number: TC2030; Type: Connector; Pins: 3
J305 = J_MH5x2_1.27: CONN HEADER SMD 10POS 1.27MM; Manufacturer: Sullins Connector Solutions; Manufacturer Part Number: GRPB052VWQS-RC; Pitch: 1.27; Type: Connector; Supplier 1: Digi-Key; Supplier Part Number 1: S9012E-05-ND; Pins: 10
P300 = P_PCH_30V_1W: MOSFET P-CH 30V 6A SOT23F; Manufacturer: Toshiba Semiconductor and Storage; Type: Transistor; Supplier 1: Digi-Key; Supplier Part Number 1: SSM3J372RLFCT-ND
P301 = P_NCH_50V_150mW: as P201 on sheet Sheet2_Power_Supply; Type: Transistor; Supplier 1: Digi-Key; Supplier Part Number 1: RU1J002YNTCLCT-ND
Q300 = Q_32k768_12p5: CRYSTAL 32.7680KHZ 12.5PF SMD; Manufacturer: NDK America, Inc.; Manufacturer Part Number: NX3215SA-32.768K-EXS00A-MU00003; Type: Other, Crystal; Supplier 1: Digi-Key; Supplier Part Number 1: 644-1313-1-ND
R300 R306 R312-R314 R320 = R_10k_0402: as R203 on sheet Sheet2_Power_Supply; Type: Resistor; Supplier 1: Digi-Key; Supplier Part Number 1: 311-10.0KLRCT-ND
R301-R305 R307 R310 R315 R319 R321 = R_270k_0402: as R200 on sheet Sheet2_Power_Supply; Type: Resistor; Supplier 1: Digi-Key; Supplier Part Number 1: 311-270KLRCT-ND
R308 R309 R311 = R_2k_0402: as R204 on sheet Sheet2_Power_Supply; Type: Resistor; Supplier 1: Digi-Key; Supplier Part Number 1: RMCF0402FT2K00CT-ND
R316-R318 R322-R324 = R_100R_0402: as R202 on sheet Sheet2_Power_Supply; Type: Resistor; Supplier 1: Digi-Key; Supplier Part Number 1: RMCF0402FT100RCT-ND
SW300 SW301 = ENC_12_THT: ROTARY ENCODER MECHANICAL 12PPR; Manufacturer: Bourns Inc.; Manufacturer Part Number: PEC11R-4220F-S0012; Supplier 1: Digi-Key; Supplier Part Number 1: PEC11R-4220F-S0012-ND; Type: other, Encoder
SW302 = SW_TactileSW_V: SWITCH TACTILE SPST-NO 0.05A 16V; Manufacturer: C&K; Manufacturer Part Number: PTS810 SJM 250 SMTR LFS; Type: other; Supplier 1: Digi-Key; Supplier Part Number 1: CKN10502CT-ND
TP300 TP301 = TP_1mm: Test Point 1mm

## Sheet Sheet4_LCD_Interface.SchDoc: =ProjectName
size A4; Organization: Marius Tetard; Address1: 2022-06 / Freiburg; DocumentNumber: 4; Revision: V2.0; SheetNumber: 4; SheetTotal: 4
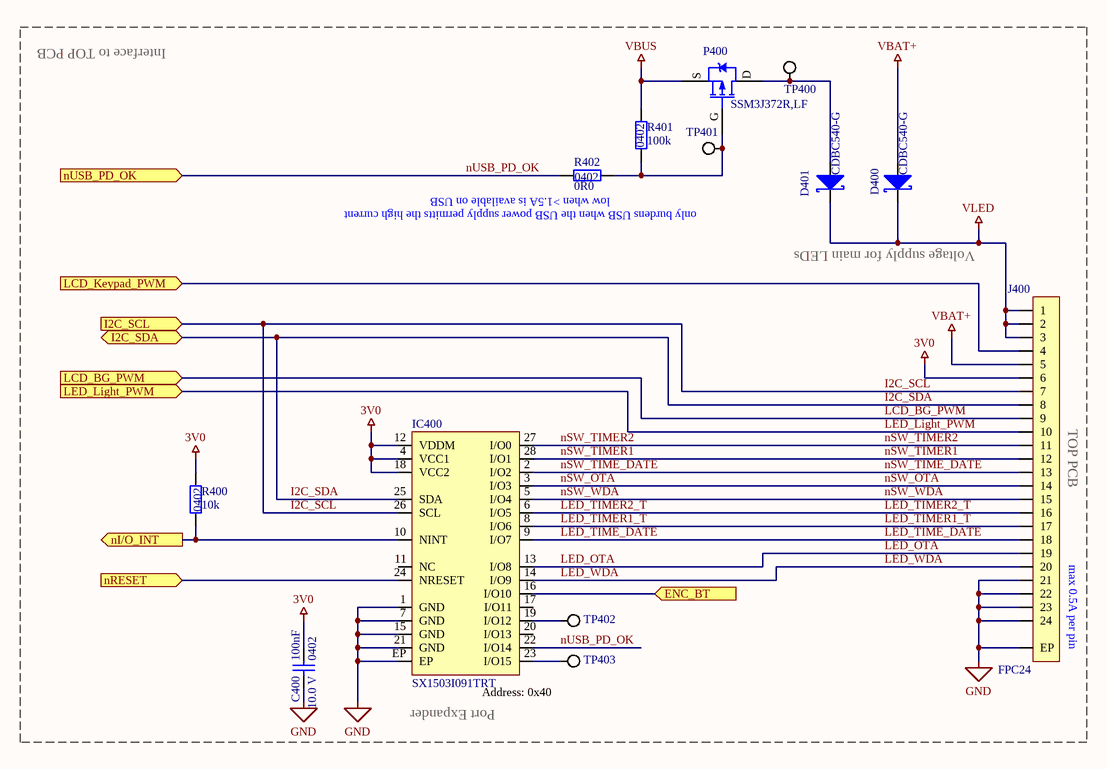
[diagram p3: Sheet4_LCD_Interface.SchDoc]

### Parts
C400  Capacitance: 100nF  Footprint: 0402  Voltage: 10.0 V  [C_0402]  (hidden comment: C 100nF 0402 10V)
D400  Manufacturer Part Number: CDBC540-G  [DO-214AB]  (hidden comment: D SCH 40V 5A)
D401  Manufacturer Part Number: CDBC540-G  [DO-214AB]  (hidden comment: D SCH 40V 5A)
IC400  SX1503I091TRT  [UFQFN-28-EP]
J400  FPC24  [J_FPC_522712479]
P400  Manufacturer Part Number: SSM3J372R,LF  [SOT-23-3-F]  (hidden comment: P PMOS 30V 6A)
R400  Resistance: 10k  Footprint: 0402  [R_0402]  (hidden comment: R 10k 0402)
R401  Resistance: 100k  Footprint: 0402  [R_0402]  (hidden comment: R 1k8 0402)
R402  Resistance: 0R0  Footprint: 0402  [R_0402]  (hidden comment: R 0R0 0402)
TP400  TP  [TP_1mm]  (value not drawn)  (net tie, no BOM)
TP401  TP  [TP_1mm]  (value not drawn)  (net tie, no BOM)
TP402  TP  [TP_1mm]  (value not drawn)  (net tie, no BOM)
TP403  TP  [TP_1mm]  (value not drawn)  (net tie, no BOM)

### Ports
ENC_BT (in), I2C_SCL (in), I2C_SDA (bidir), LCD_BG_PWM (in), LCD_Keypad_PWM (in), LED_Light_PWM (in), nI/O_INT (out), nRESET (in), nUSB_PD_OK (in)

### Nets
3V0: C400.2 IC400.4(VCC1) IC400.12(VDDM) IC400.18(VCC2) J400.6 R400.2
GND: C400.1 IC400.1(GND) IC400.7(GND) IC400.15(GND) IC400.21(GND) IC400.EP J400.21 J400.22 J400.23 J400.24 J400.EP
VBAT+: D400.2(A) J400.5
VBUS: P400.2(S) R401.2
VLED: D400.1(K) D401.1(K) J400.1 J400.2 J400.3
ENC_BT: IC400.16(I/O10) ; port ENC_BT
I2C_SCL: IC400.26(SCL) J400.7 ; port I2C_SCL
I2C_SDA: IC400.25(SDA) J400.8 ; port I2C_SDA
LCD_BG_PWM: J400.9 ; port LCD_BG_PWM
LCD_Keypad_PWM: J400.4 ; port LCD_Keypad_PWM
LED_Light_PWM: J400.10 ; port LED_Light_PWM
LED_OTA: IC400.13(I/O8) J400.19
LED_TIME_DATE: IC400.9(I/O7) J400.18
LED_TIMER1_T: IC400.8(I/O6) J400.17
LED_TIMER2_T: IC400.6(I/O5) J400.16
LED_WDA: IC400.14(I/O9) J400.20
nI/O_INT: IC400.10(NINT) R400.1 ; port nI/O_INT
nRESET: IC400.24(NRESET) ; port nRESET
nSW_OTA: IC400.3(I/O3) J400.14
nSW_TIME_DATE: IC400.2(I/O2) J400.13
nSW_TIMER1: IC400.28(I/O1) J400.12
nSW_TIMER2: IC400.27(I/O0) J400.11
nSW_WDA: IC400.5(I/O4) J400.15
nUSB_PD_OK: IC400.22(I/O14) R402.2 ; port nUSB_PD_OK
NetD401_2: D401.2(A) P400.3(D) TP400.1(TP)
NetIC400_19: IC400.19(I/O12) TP402.1(TP)
NetIC400_23: IC400.23(I/O15) TP403.1(TP)
NetP400_1: P400.1(G) R401.1 R402.1 TP401.1(TP)

Not connected (* = marked no-connect by the designer): IC400 11(NC) 17(I/O11) 20(I/O13)

### Notes on the sheet
- Interface to TOP PCB
- (near R402) low when >1.5A is available on USB
- (near R402) only burdens USB when the USB power supply permitts the high current
- Voltage supply for main LEDs
- (near J400) TOP PCB
- (near J400) max 0.5A per pin
- (near IC400) Port Expander
- (near IC400) Address: 0x40
- Title
- Size:
- Date:
- A4
- Number:
- Time:
- Revision:
- Sheet
- of
- File:

### Library data of the parts
C400 = CAP_100nF_10V_0402: as C204 on sheet Sheet2_Power_Supply; Supplier 1: Digi-Key; Supplier Part Number 1: 1276-1443-1-ND
D400 D401 = D_SCH_40V_5A: DIODE SCHOTTKY 40V 5A DO214AB; Manufacturer: Comchip Technology; Type: Diode; Supplier 1: Digi-Key; Supplier Part Number 1: 641-1126-1-ND
IC400 = IC_16ch_Port_Extender_2: IC GPIO EXPANDER I2C 16CH 28-QFN; Manufacturer: Semtech Corporation; Manufacturer Part Number: SX1503I091TRT; Type: IC, Driver; Supplier 1: Digi-Key; Supplier Part Number 1: SX1503I091CT-ND
J400 = J_FPC24_DS: CONN FPC BOT 24 PIN 1mm Pitch; Manufacturer: MOLEX; Manufacturer Part Number: 522712479; Pitch: 1.0; Type: Connector; Supplier 1: LCSC; Supplier Part Number 1: C293627; Pins: 24
P400 = P_PCH_30V_1W: as P300 on sheet Sheet3_MCU; Type: Transistor; Supplier 1: Digi-Key; Supplier Part Number 1: SSM3J372RLFCT-ND
R400 = R_10k_0402: as R203 on sheet Sheet2_Power_Supply; Type: Resistor; Supplier 1: Digi-Key; Supplier Part Number 1: 311-10.0KLRCT-ND
R401 = R_100k_0402: RES 100K OHM 5% 1/16W 0402; Manufacturer: YAGEO; Manufacturer Part Number: RC0402JR-07100KL; Type: Resistor; Supplier 1: Digi-Key; Supplier Part Number 1: 311-100KJRCT-ND
R402 = R_0R0_0402: as R218 on sheet Sheet2_Power_Supply; Type: Resistor; Supplier 1: Digi-Key; Supplier Part Number 1: RMCF0402ZT0R00CT-ND
TP400-TP403 = TP_1mm: Test Point 1mm

## Nets that join several sheets
3V0: Sheet2_Power_Supply (R218.2 R219.2), Sheet3_MCU (15 pins), Sheet4_LCD_Interface (6 pins)
GND: Sheet2_Power_Supply (33 pins), Sheet3_MCU (32 pins), Sheet4_LCD_Interface (11 pins)
VBAT+: Sheet2_Power_Supply (10 pins), Sheet3_MCU (P300.2 R310.2), Sheet4_LCD_Interface (D400.2 J400.5)
VBUS: Sheet2_Power_Supply (9 pins), Sheet4_LCD_Interface (P400.2 R401.2)
ENC_BT: Sheet3_MCU (C301.2 R307.1), Sheet4_LCD_Interface (IC400.16)
I2C_SCL: Sheet3_MCU (IC300.3 IC301.6 IC302.16 R314.1), Sheet4_LCD_Interface (IC400.26 J400.7)
I2C_SDA: Sheet3_MCU (IC300.4 IC301.5 IC302.17 R313.1), Sheet4_LCD_Interface (IC400.25 J400.8)
LCD_BG_PWM: Sheet3_MCU (IC302.13), Sheet4_LCD_Interface (J400.9)
LCD_Keypad_PWM: Sheet3_MCU (IC302.8), Sheet4_LCD_Interface (J400.4)
LED_Light_PWM: Sheet3_MCU (IC302.14), Sheet4_LCD_Interface (J400.10)
nI/O_INT: Sheet3_MCU (IC302.1), Sheet4_LCD_Interface (IC400.10 R400.1)
nRESET: Sheet3_MCU (6 pins), Sheet4_LCD_Interface (IC400.24)
nUSB_PD_OK: Sheet2_Power_Supply (P201.3 P202.3 TP210.1), Sheet4_LCD_Interface (IC400.22 R402.2)
VBAT/2: Sheet2_Power_Supply (R200.1 R201.2), Sheet3_MCU (IC302.7)

## Assembly variants
Alarm Clock: not fitted J200 J205 R400